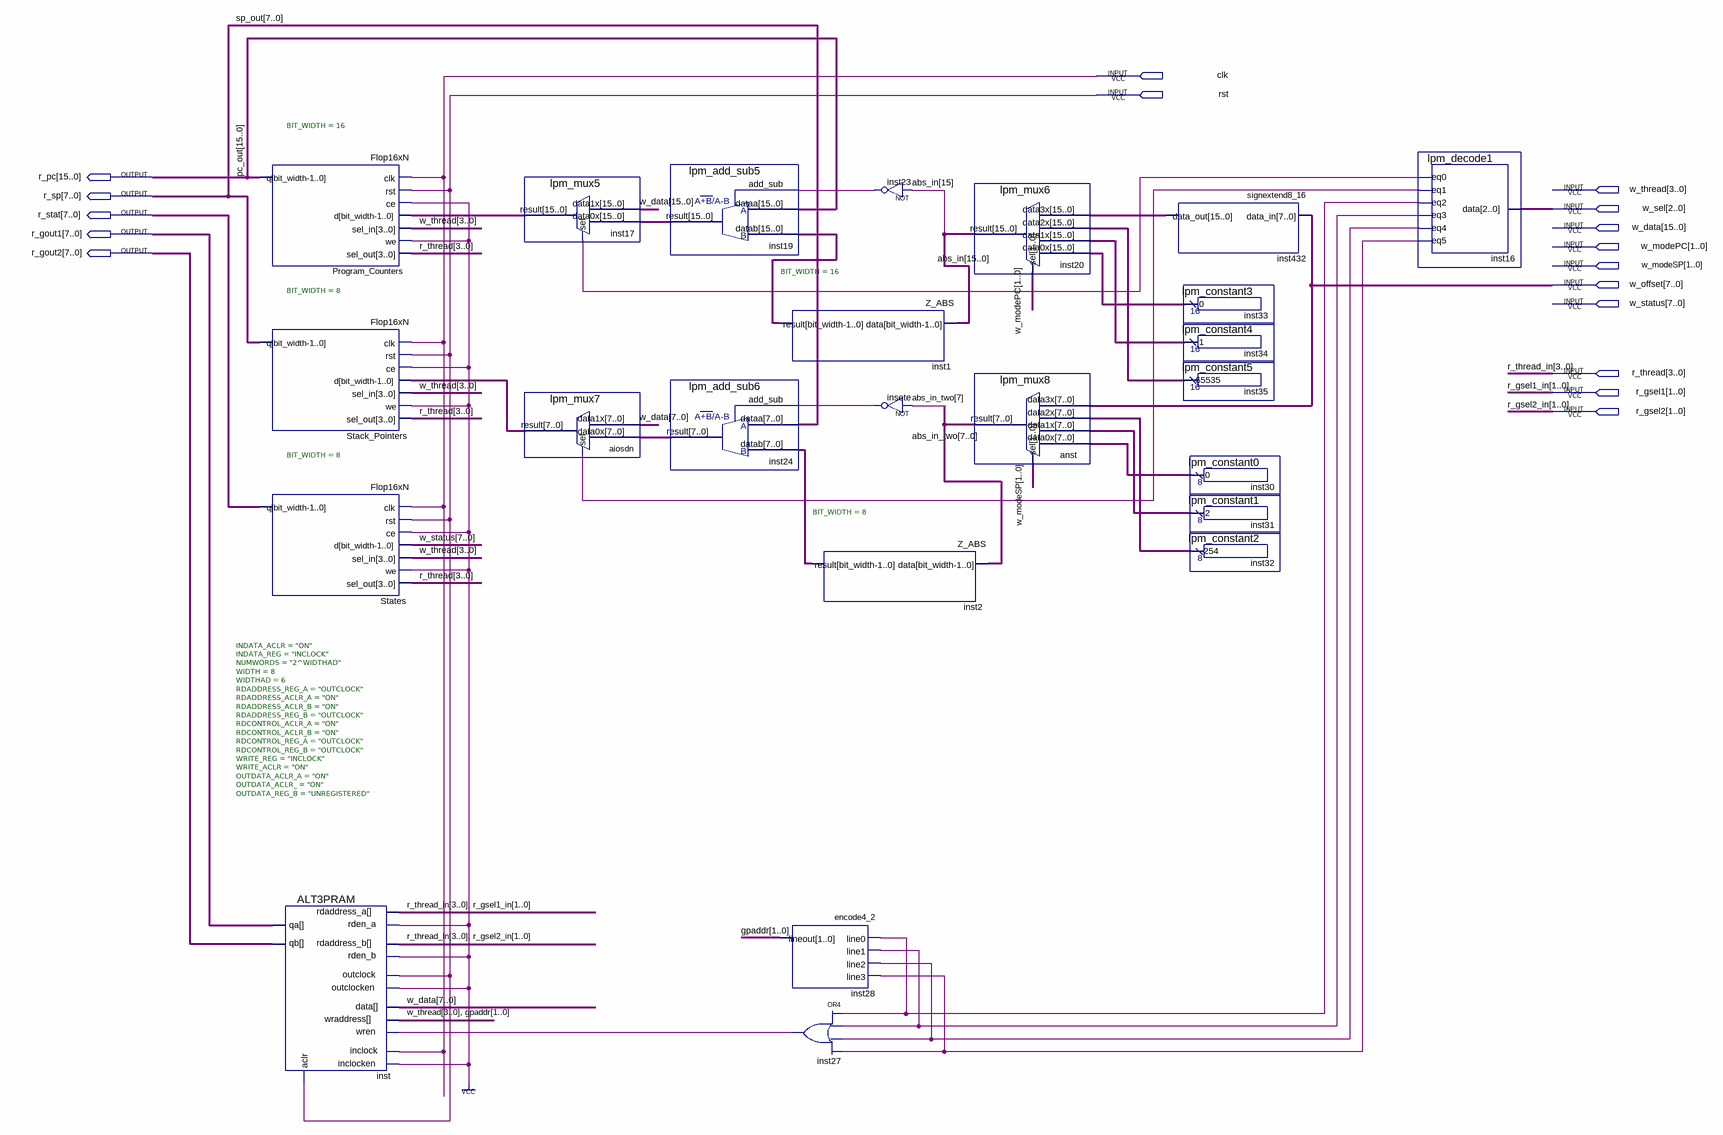
[diagram p0: schematic sheet]
// Quartus schematic regile.bdf as structural Verilog: 24 symbols, 17 pins
module regile (
  input  clk,
  input  rst,
  input  [3:0] w_thread,
  input  [2:0] w_sel,
  input  [15:0] w_data,
  input  [1:0] w_modePC,
  input  [1:0] w_modeSP,
  input  [7:0] w_offset,
  input  [7:0] w_status,
  input  [3:0] r_thread,
  input  [1:0] r_gsel1,
  input  [1:0] r_gsel2,
  output [15:0] r_pc,
  output [7:0] r_sp,
  output [7:0] r_stat,
  output [7:0] r_gout1,
  output [7:0] r_gout2
);

  wire insete_out, inst16_eq0, inst16_eq1, inst16_eq2, inst16_eq3, inst16_eq4, inst16_eq5, inst23_out,
       inst27_out;
  wire [1:0] gpaddr;
  wire [7:0] abs_in_two, aiosdn_result, inst2_result, inst24_result, inst30_result, inst31_result,
       inst32_result;
  wire [15:0] abs_in, inst1_result, inst17_result, inst19_result, inst33_result, inst34_result,
       inst35_result, inst432_data_out;

  Flop16xN #(.BIT_WIDTH(16)) Program_Counters (
    .clk(clk), .rst(rst), .ce(1'b1), .d(inst17_result), .sel_in(w_thread), .we(1'b1), .sel_out(r_thread),
    .q(r_pc));
  Flop16xN #(.BIT_WIDTH(8)) Stack_Pointers (
    .clk(clk), .rst(rst), .ce(1'b1), .d(aiosdn_result), .sel_in(w_thread), .we(1'b1), .sel_out(r_thread),
    .q(r_sp));
  Flop16xN #(.BIT_WIDTH(8)) States (
    .clk(clk), .rst(rst), .ce(1'b1), .d(w_status), .sel_in(w_thread), .we(1'b1), .sel_out(r_thread),
    .q(r_stat));
  ALT3PRAM #(.INDATA_ACLR("ON"), .INDATA_REG("INCLOCK"), .NUMWORDS("2^WIDTHAD"), .WIDTH(8), .WIDTHAD(6), .RDADDRESS_REG_A("OUTCLOCK"), .RDADDRESS_ACLR_A("ON"), .RDADDRESS_ACLR_B("ON"), .RDADDRESS_REG_B("OUTCLOCK"), .RDCONTROL_ACLR_A("ON"), .RDCONTROL_ACLR_B("ON"), .RDCONTROL_REG_A("OUTCLOCK"), .RDCONTROL_REG_B("OUTCLOCK"), .WRITE_REG("INCLOCK"), .WRITE_ACLR("ON"), .OUTDATA_ACLR_A("ON"), .OUTDATA_ACLR_("ON"), .OUTDATA_REG_B("UNREGISTERED")) inst (
    .aclr(rst), .rden_b(1'b1), .rdaddress_b({r_thread, r_gsel2}), .rdaddress_a({r_thread, r_gsel1}),
    .rden_a(1'b1), .outclock(rst), .outclocken(1'b1), .wraddress({w_thread, gpaddr}), .data(w_data[7:0]),
    .wren(inst27_out), .inclock(clk), .inclocken(1'b1), .qa(r_gout1), .qb(r_gout2));
  lpm_mux5 inst17 (.data1x(w_data), .data0x(inst19_result), .sel(inst16_eq0), .result(inst17_result));
  lpm_mux7 aiosdn (.data1x(w_data[7:0]), .data0x(inst24_result), .sel(inst16_eq1), .result(aiosdn_result));
  lpm_add_sub5 inst19 (.add_sub(inst23_out), .dataa(r_pc), .datab(inst1_result), .result(inst19_result));
  lpm_add_sub6 inst24 (.add_sub(insete_out), .dataa(r_sp), .datab(inst2_result), .result(inst24_result));
  Z_ABS #(.BIT_WIDTH(16)) inst1 (.data(abs_in), .result(inst1_result));
  encode4_2 inst28 (.line0(inst16_eq2), .line1(inst16_eq3), .line2(inst16_eq4), .line3(inst16_eq5), .lineout(gpaddr));
  Z_ABS #(.BIT_WIDTH(8)) inst2 (.data(abs_in_two), .result(inst2_result));
  or inst27 (inst27_out, inst16_eq2, inst16_eq3, inst16_eq4, inst16_eq5);
  not inst23 (inst23_out, abs_in[15]);
  not insete (insete_out, abs_in_two[7]);
  lpm_mux6 inst20 (
    .data3x(inst432_data_out), .data2x(inst35_result), .data1x(inst34_result), .data0x(inst33_result),
    .sel(w_modePC), .result(abs_in));
  lpm_mux8 anst (
    .data3x(w_offset), .data2x(inst32_result), .data1x(inst31_result), .data0x(inst30_result),
    .sel(w_modeSP), .result(abs_in_two));
  signextend8_16 inst432 (.data_in(w_offset), .data_out(inst432_data_out));
  lpm_constant3 inst33 (.result(inst33_result));
  lpm_constant4 inst34 (.result(inst34_result));
  lpm_constant5 inst35 (.result(inst35_result));
  lpm_constant0 inst30 (.result(inst30_result));
  lpm_constant1 inst31 (.result(inst31_result));
  lpm_constant2 inst32 (.result(inst32_result));
  lpm_decode1 inst16 (
    .data(w_sel), .eq0(inst16_eq0), .eq1(inst16_eq1), .eq2(inst16_eq2), .eq3(inst16_eq3), .eq4(inst16_eq4),
    .eq5(inst16_eq5));

  // Other names for the same wires on the sheet: r_gsel1_in[1:0] = r_gsel1; r_gsel2_in[1:0] = r_gsel2;
  //   pc_out[15:0] = r_pc; sp_out[7:0] = r_sp; r_thread_in[3:0] = r_thread
endmodule
